# Altium project DCDC.PrjPCB
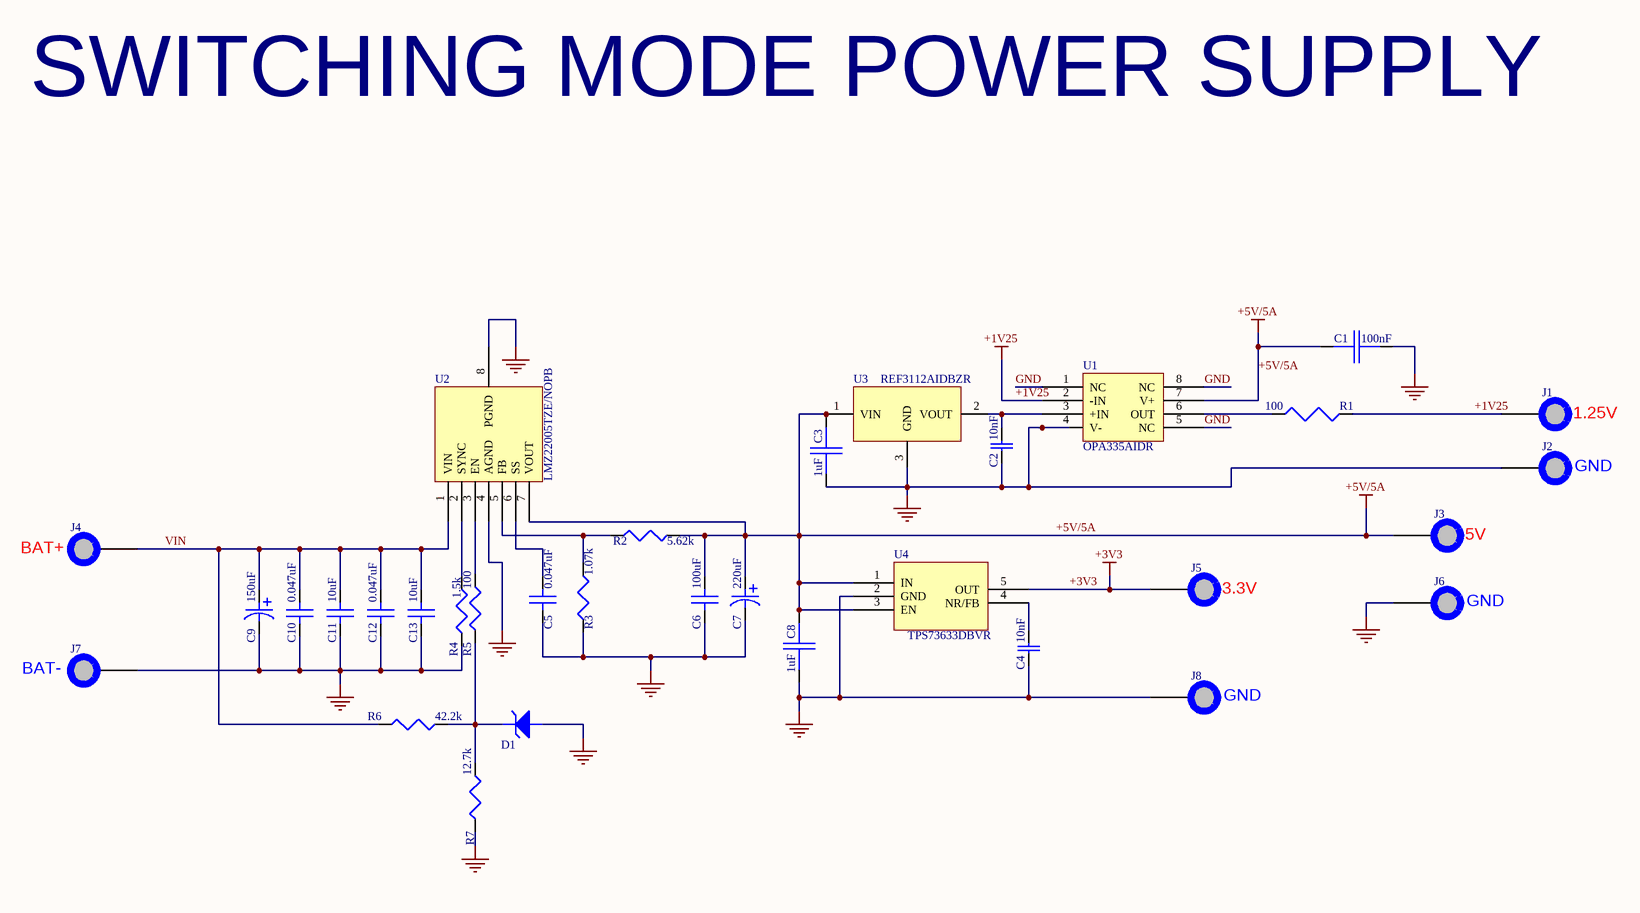
[diagram p0: DCDC.SchDoc]
1 sheet, 33 parts. Net scope: global (net labels, ports and power ports of the same name join across sheets).
Board file: DCDC.PcbDoc

## Sheet DCDC.SchDoc
size A3

### Parts
C1  100nF  [C0603]
C2  10nF  [C0805]
C3  1uF  [C0603]
C4  10nF  [C0805]
C5  0.047uF  [C1206]
C6  100uF  [C1210]
C7  220uF  [EEF-UE]
C8  1uF  [C0603]
C9  150uF  [FK-G]
C10  0.047uF  [C1206]
C11  10uF  [C1206]
C12  0.047uF  [C1206]
C13  10uF  [C1206]
D1  MMSZ5231BS-7-F  [SOD323]  (value not drawn)
J1  PAD_4mmx1.5mm_Hole  [PAD_WITH_HOLE_4x1mm]  (value not drawn)
J2  PAD_4mmx1.5mm_Hole  [PAD_WITH_HOLE_4x1mm]  (value not drawn)
J3  PAD_4mmx1.5mm_Hole  [PAD_WITH_HOLE_4x1mm]  (value not drawn)
J4  PAD_4mmx1.5mm_Hole  [PAD_WITH_HOLE_4x1mm]  (value not drawn)
J5  PAD_4mmx1.5mm_Hole  [PAD_WITH_HOLE_4x1mm]  (value not drawn)
J6  PAD_4mmx1.5mm_Hole  [PAD_WITH_HOLE_4x1mm]  (value not drawn)
J7  PAD_4mmx1.5mm_Hole  [PAD_WITH_HOLE_4x1mm]  (value not drawn)
J8  PAD_4mmx1.5mm_Hole  [PAD_WITH_HOLE_4x1mm]  (value not drawn)
R1  100  [R0603]
R2  5.62k  [R0805]
R3  1.07k  [R0805]
R4  1.5k  [R0805]
R5  100  [R0805]
R6  42.2k  [R0805]
R7  12.7k  [R0805]
U1  OPA335AIDR  [SO-8]
U2  LMZ22005TZE/NOPB  [NDW0007A]
U3  REF3112AIDBZR  [SOT-23]
U4  TPS73633DBVR  [SOT23-5]

### Nets
+1V25: J1.1 R1.1 U1.2(-IN)
+3V3: J5.1 U4.5(OUT)
+5V/5A: C1.2 C3.2 C6.1 C7.1 C8.2 J3.1 R2.2 U1.7(V+) U2.7(VOUT) U3.1(VIN) U4.1(IN) U4.3(EN)
GND: C1.1 C2.1 C3.1 C4.1 C5.2 C6.2 C7.2 C8.1 C9.2 C10.2 C11.1 C12.2 C13.1 D1.1 J2.1 J6.1 J7.1 J8.1 R3.1 R4.1 R7.2 U1.1(NC) U1.4(V-) U1.5(NC) U1.8(NC) U2.4(AGND) U2.8(PGND) U3.3(GND) U4.2(GND)
VIN: C9.1 C10.1 C11.2 C12.1 C13.2 J4.1 R6.1 U2.1(VIN)
NetC2_2: C2.2 U1.3(+IN) U3.2(VOUT)
NetC4_2: C4.2 U4.4(NR/FB)
NetC5_1: C5.1 U2.6(SS)
NetD1_2: D1.2 R5.1 R6.2 R7.1
NetR1_2: R1.2 U1.6(OUT)
NetR2_1: R2.1 R3.2 U2.5(FB)
NetR4_2: R4.2 U2.2(SYNC)
NetR5_2: R5.2 U2.3(EN)

### Notes on the sheet
- SWITCHING MODE POWER SUPPLY
- (near J1) 1.25V
- (near J2) GND
- (near J4) BAT+
- (near J5) 3.3V
- (near J3) 5V
- (near J6) GND
- (near J7) BAT-
- (near J8) GND

### Library data of the parts
C1 = GRM188R71E104KA01D: CAP CER 0.1UF 25V X7R 0603; Manufacturer: Murata Electronics North America; Capacitance: 0.1µF; Tolerance: ±10%; Supplier 1: Digi-Key; Manufacturer Part Number: GRM188R71E104KA01D; RoHS: RoHS Compliant; Category: Capacitors; Stock 1: 5973420; Pricing 1: 1=0.1, 10=0.019, 50=0.0104, 100=0.0088, 250=0.0072, 500=0.00616, 1000=0.0048 (USD); Packaging: Cut Tape (CT); Voltage - Rated: 25V; Temperature Coefficient: X7R; Mounting Type: Surface Mount, MLCC; Operating Temperature: -55°C ~ 125°C; Applications: General Purpose; Ratings: -; Package / Case: 0603 (1608 Metric); Size / Dimension: 0.063" L x 0.031" W (1.60mm x 0.80mm); Height - Seated (Max): -; Thickness (Max): 0.035" (0.90mm); Lead Spacing: -; Features: -; Lead Style: -; ComponentLink1URL: http://www.murata.com/~/media/webrenewal/support/library/catalog/products/capacitor/mlcc/c02e.pdf; ComponentLink1Description: http://www.murata.com/~/media/webrenewal/support/library/catalog/products/capacitor/mlcc/c02e.pdf; Supplier Part Number 1: 490-1524-1-ND
C2 C4 = GRM216R71H103KA01D: CAP CER 10000PF 50V X7R 0805; Manufacturer: Murata Electronics North America; Tolerance: ±10%; Supplier 1: Digi-Key; Manufacturer Part Number: GRM216R71H103KA01D; RoHS: RoHS Compliant; Category: Capacitors; Stock 1: 1473285; Pricing 1: 1=0.1, 10=0.031, 50=0.0168, 100=0.0142, 250=0.01164, 500=0.00998, 1000=0.00777 (USD); Packaging: Cut Tape (CT); Capacitance: 10000pF; Voltage - Rated: 50V; Temperature Coefficient: X7R; Mounting Type: Surface Mount, MLCC; Operating Temperature: -55°C ~ 125°C; Applications: General Purpose; Ratings: -; Package / Case: 0805 (2012 Metric); Size / Dimension: 0.079" L x 0.049" W (2.00mm x 1.25mm); Height - Seated (Max): -; Thickness (Max): 0.028" (0.70mm); Lead Spacing: -; Features: -; Lead Style: -; ComponentLink1URL: http://www.murata.com/~/media/webrenewal/support/library/catalog/products/capacitor/mlcc/c02e.pdf; ComponentLink1Description: http://www.murata.com/~/media/webrenewal/support/library/catalog/products/capacitor/mlcc/c02e.pdf; Supplier Part Number 1: 490-1664-1-ND
C3 C8 = GRM188R61E105KA12D: CAP CER 1UF 25V X5R 0603; Manufacturer: Murata Electronics North America; Capacitance: 1µF; Tolerance: ±10%; Supplier 1: Digi-Key; Manufacturer Part Number: GRM188R61E105KA12D; RoHS: RoHS Compliant; Category: Capacitors; Stock 1: 1934941; Pricing 1: 1=0.1, 10=0.044, 50=0.0238, 100=0.0202, 250=0.01652, 500=0.01412, 1000=0.01101 (USD); Packaging: Cut Tape (CT); Voltage - Rated: 25V; Temperature Coefficient: X5R; Mounting Type: Surface Mount, MLCC; Operating Temperature: -55°C ~ 85°C; Applications: General Purpose; Ratings: -; Package / Case: 0603 (1608 Metric); Size / Dimension: 0.063" L x 0.031" W (1.60mm x 0.80mm); Height - Seated (Max): -; Thickness (Max): 0.035" (0.90mm); Lead Spacing: -; Features: -; Lead Style: -; ComponentLink1URL: http://www.murata.com/~/media/webrenewal/support/library/catalog/products/capacitor/mlcc/c02e.pdf; ComponentLink1Description: http://www.murata.com/~/media/webrenewal/support/library/catalog/products/capacitor/mlcc/c02e.pdf; Supplier Part Number 1: 490-3897-1-ND
C5 C10 C12 = C1206C474K5RACTU: CAP CER 0.47UF 50V X7R 1206; Manufacturer: Kemet; Capacitance: 0.47µF; Tolerance: ±10%; Supplier 1: Digi-Key; Manufacturer Part Number: C1206C474K5RACTU; RoHS: RoHS Compliant; Category: Capacitors; Stock 1: 21625; Pricing 1: 1=0.34, 10=0.295, 50=0.1794, 100=0.1477, 250=0.11816, 500=0.10762, 1000=0.09706 (USD); Packaging: Cut Tape (CT); Voltage - Rated: 50V; Temperature Coefficient: X7R; Mounting Type: Surface Mount, MLCC; Operating Temperature: -55°C ~ 125°C; Applications: General Purpose; Ratings: -; Package / Case: 1206 (3216 Metric); Size / Dimension: 0.126" L x 0.063" W (3.20mm x 1.60mm); Height - Seated (Max): -; Thickness (Max): 0.039" (1.00mm); Lead Spacing: -; Features: -; Lead Style: -; ComponentLink1URL: http://www.kemet.com/docfinder?Partnumber=C1206C474K5RACTU; ComponentLink1Description: http://www.kemet.com/docfinder?Partnumber=C1206C474K5RACTU; Supplier Part Number 1: 399-3498-1-ND
C6 = C3225X5R0J107M250AC: CAP CER 100UF 6.3V X5R 1210; Manufacturer: TDK Corporation; Capacitance: 100µF; Tolerance: ±20%; Supplier 1: Digi-Key; Manufacturer Part Number: C3225X5R0J107M250AC; RoHS: RoHS Compliant; Category: Capacitors; Stock 1: 64128; Pricing 1: 1=1.32, 10=1.103, 100=0.7041, 250=0.58676, 500=0.52808 (USD); Packaging: Cut Tape (CT); Voltage - Rated: 6.3V; Temperature Coefficient: X5R; Mounting Type: Surface Mount, MLCC; Operating Temperature: -55°C ~ 85°C; Applications: General Purpose; Ratings: -; Package / Case: 1210 (3225 Metric); Size / Dimension: 0.126" L x 0.098" W (3.20mm x 2.50mm); Height - Seated (Max): -; Thickness (Max): 0.114" (2.90mm); Lead Spacing: -; Features: -; Lead Style: -; ComponentLink1URL: https://product.tdk.com/info/en/catalog/datasheets/mlcc_commercial_general_en.pdf; ComponentLink1Description: https://product.tdk.com/info/en/catalog/datasheets/mlcc_commercial_general_en.pdf; Supplier Part Number 1: 445-1437-1-ND
C7 = EEF-UE0J221LR: CAP POLYMER 220UF 20% 6.3V SMD; Manufacturer: Panasonic Electronic Components; Capacitance: 220µF; ESR (Equivalent Series Resistance): 7 mOhm; Lifetime @ Temp.: 1000 Hrs @ 105°C; Ripple Current: 3.7A; Surface Mount Land Size: 0.287" L x 0.169" W (7.30mm x 4.30mm); Supplier 1: Digi-Key; Manufacturer Part Number: EEF-UE0J221LR; RoHS: RoHS Compliant; Category: Capacitors; Stock 1: 5849; Pricing 1: 1=3.48, 10=2.885, 25=2.758, 50=2.673, 100=2.5458, 250=2.37608, 500=2.1215, 1000=1.6972 (USD); Packaging: Cut Tape (CT); Tolerance: ±20%; Voltage Rating: 6.3V; Operating Temperature: -40°C ~ 105°C; Type: Polymer; Applications: -; Impedance: -; Lead Spacing: -; Size / Dimension: 0.287" L x 0.169" W (7.30mm x 4.30mm); Height - Seated (Max): 0.165" (4.20mm); Mounting Type: Surface Mount; Package / Case: 2917 (7343 Metric); ComponentLink1URL: http://media.digikey.com/pdf/Data%20Sheets/Panasonic%20Capacitors%20PDFs/FD_CD_UD_UE_Rev_Mar2015.pdf; ComponentLink1Description: http://media.digikey.com/pdf/Data%20Sheets/Panasonic%20Capacitors%20PDFs/FD_CD_UD_UE_Rev_Mar2015.pdf; Supplier Part Number 1: PCE4263CT-ND
C9 = EEE-FK1H151P: CAP ALUM 150UF 20% 50V SMD; Manufacturer: Panasonic Electronic Components; Capacitance: 150µF; Lifetime @ Temp.: 2000 Hrs @ 105°C; Type: Polar; Ripple Current: 502.5mA; Impedance: 180 mOhm; Surface Mount Land Size: 0.406" L x 0.406" W (10.30mm x 10.30mm); Supplier 1: Digi-Key; Manufacturer Part Number: EEE-FK1H151P; RoHS: RoHS Compliant; Category: Capacitors; Stock 1: 50085; Pricing 1: 1=1.09, 50=0.6968, 100=0.6271, 250=0.54004 (USD); Packaging: Cut Tape (CT); Tolerance: ±20%; Voltage Rating: 50V; ESR (Equivalent Series Resistance): -; Operating Temperature: -55°C ~ 105°C; Applications: Automotive; Lead Spacing: -; Size / Dimension: 0.394" Dia (10.00mm); Height - Seated (Max): 0.402" (10.20mm); Mounting Type: Surface Mount; Package / Case: Radial, Can - SMD; ComponentLink1URL: http://industrial.panasonic.com/www-cgi/jvcr13pz.cgi?E+PZ+4+ABA0120+EEEFK1H151P+8+WW; ComponentLink1Description: http://industrial.panasonic.com/www-cgi/jvcr13pz.cgi?E+PZ+4+ABA0120+EEEFK1H151P+8+WW; Supplier Part Number 1: PCE3810CT-ND
C11 C13 = GRM31CR61H106KA12L: CAP CER 10UF 50V X5R 1206; Manufacturer: Murata Electronics North America; Capacitance: 10µF; Tolerance: ±10%; Supplier 1: Digi-Key; Manufacturer Part Number: GRM31CR61H106KA12L; RoHS: RoHS Compliant; Category: Capacitors; Stock 1: 91419; Pricing 1: 1=0.65, 10=0.624, 50=0.3724, 100=0.3026, 250=0.25136, 500=0.2281, 1000=0.20948 (USD); Packaging: Cut Tape (CT); Voltage - Rated: 50V; Temperature Coefficient: X5R; Mounting Type: Surface Mount, MLCC; Operating Temperature: -55°C ~ 85°C; Applications: General Purpose; Ratings: -; Package / Case: 1206 (3216 Metric); Size / Dimension: 0.126" L x 0.063" W (3.20mm x 1.60mm); Height - Seated (Max): -; Thickness (Max): 0.071" (1.80mm); Lead Spacing: -; Features: -; Lead Style: -; ComponentLink1URL: http://www.murata.com/~/media/webrenewal/support/library/catalog/products/capacitor/mlcc/c02e.pdf; ComponentLink1Description: http://www.murata.com/~/media/webrenewal/support/library/catalog/products/capacitor/mlcc/c02e.pdf; Supplier Part Number 1: 490-5961-1-ND
D1 = MMSZ5231BS-7-F: DIODE ZENER 5.1V 200MW SOD323; Manufacturer: Diodes Incorporated; Tolerance: ±5%; Impedance (Max) (Zzt): 17 Ohm; Current - Reverse Leakage @ Vr: 5µA @ 2V; Voltage - Forward (Vf) (Max) @ If: 900mV @ 10mA; Supplier 1: Digi-Key; Manufacturer Part Number: MMSZ5231BS-7-F; RoHS: RoHS Compliant; Category: Discrete Semiconductor Products; Stock 1: 8256; Pricing 1: 1=0.27, 10=0.222, 100=0.1174, 500=0.0772, 1000=0.0526 (USD); Packaging: Cut Tape (CT); Voltage - Zener (Nom) (Vz): 5.1V; Power - Max: 200mW; Operating Temperature: -65°C ~ 150°C; Mounting Type: Surface Mount; Package / Case: SC-76, SOD-323; Supplier Device Package: SOD-323; ComponentLink1URL: http://www.diodes.com/_files/datasheets/ds31038.pdf; ComponentLink1Description: http://www.diodes.com/_files/datasheets/ds31038.pdf; Supplier Part Number 1: MMSZ5231BS-FDICT-ND
J1-J8 = PAD_4mmx1.5mm_Hole: Pad 4mm x 1.5mm with hole
R1 = ERJ-3EKF1000V: RES SMD 100 OHM 1% 1/10W 0603; Manufacturer: Panasonic Electronic Components; Power (Watts): 0.1W, 1/10W; Temperature Coefficient: ±100ppm/°C; Supplier 1: Digi-Key; Manufacturer Part Number: ERJ-3EKF1000V; RoHS: RoHS Compliant; Category: Resistors; Stock 1: 2225240; Pricing 1: 1=0.1, 50=0.0114, 100=0.0084, 250=0.00644, 500=0.00514, 1000=0.00379 (USD); Packaging: Cut Tape (CT); Resistance (Ohms): 100; Tolerance: ±1%; Composition: Thick Film; Features: Automotive AEC-Q200; Operating Temperature: -55°C ~ 155°C; Package / Case: 0603 (1608 Metric); Supplier Device Package: 0603; Size / Dimension: 0.063" L x 0.031" W (1.60mm x 0.80mm); Height: 0.022" (0.55mm); Number of Terminations: 2; ComponentLink1URL: http://industrial.panasonic.com/www-cgi/jvcr13pz.cgi?E+PZ+3+AOA0002+ERJ3EKF1000V+7+WW; ComponentLink1Description: http://industrial.panasonic.com/www-cgi/jvcr13pz.cgi?E+PZ+3+AOA0002+ERJ3EKF1000V+7+WW; Supplier Part Number 1: P100HCT-ND
R2 = CRCW08055K62FKEAHP: RES SMD 5.62K OHM 1% 1/3W 0805; Manufacturer: Vishay Dale; Power (Watts): 0.333W, 1/3W; Temperature Coefficient: ±100ppm/°C; Supplier 1: Digi-Key; Manufacturer Part Number: CRCW08055K62FKEAHP; RoHS: RoHS Compliant; Category: Resistors; Stock 1: 970; Pricing 1: 1=0.25, 10=0.212, 25=0.154, 50=0.1116, 100=0.0828, 250=0.06352, 500=0.05006, 1000=0.03465, 2500=0.03176 (USD); Packaging: Cut Tape (CT); Resistance (Ohms): 5.62k; Tolerance: ±1%; Composition: Thick Film; Features: Automotive AEC-Q200, Pulse Withstanding; Operating Temperature: -55°C ~ 155°C; Package / Case: 0805 (2012 Metric); Supplier Device Package: 0805 (2012 Metric); Size / Dimension: 0.079" L x 0.049" W (2.00mm x 1.25mm); Height: 0.024" (0.60mm); Number of Terminations: 2; ComponentLink1URL: http://www.vishay.com/docs/20043/crcwhpe3.pdf; ComponentLink1Description: http://www.vishay.com/docs/20043/crcwhpe3.pdf; Supplier Part Number 1: 541-5.62KTCT-ND
R3 = ERJ-6ENF1071V: RES SMD 1.07K OHM 1% 1/8W 0805; Manufacturer: Panasonic Electronic Components; Power (Watts): 0.125W, 1/8W; Temperature Coefficient: ±100ppm/°C; Supplier 1: Digi-Key; Manufacturer Part Number: ERJ-6ENF1071V; RoHS: RoHS Compliant; Category: Resistors; Stock 1: 61402; Pricing 1: 1=0.1, 50=0.022, 100=0.0162, 250=0.01236, 500=0.0099, 1000=0.00729 (USD); Packaging: Cut Tape (CT); Resistance (Ohms): 1.07k; Tolerance: ±1%; Composition: Thick Film; Features: Automotive AEC-Q200; Operating Temperature: -55°C ~ 155°C; Package / Case: 0805 (2012 Metric); Supplier Device Package: 0805; Size / Dimension: 0.079" L x 0.049" W (2.00mm x 1.25mm); Height: 0.028" (0.70mm); Number of Terminations: 2; ComponentLink1URL: http://industrial.panasonic.com/www-cgi/jvcr13pz.cgi?E+PZ+3+AOA0002+ERJ6ENF1071V+7+WW; ComponentLink1Description: http://industrial.panasonic.com/www-cgi/jvcr13pz.cgi?E+PZ+3+AOA0002+ERJ6ENF1071V+7+WW; Supplier Part Number 1: P1.07KCCT-ND
R4 = ERJ-6ENF1501V: RES SMD 1.5K OHM 1% 1/8W 0805; Manufacturer: Panasonic Electronic Components; Power (Watts): 0.125W, 1/8W; Temperature Coefficient: ±100ppm/°C; Supplier 1: Digi-Key; Manufacturer Part Number: ERJ-6ENF1501V; RoHS: RoHS Compliant; Category: Resistors; Stock 1: 278373; Pricing 1: 1=0.1, 50=0.022, 100=0.0162, 250=0.01236, 500=0.0099, 1000=0.00729 (USD); Packaging: Cut Tape (CT); Resistance (Ohms): 1.5k; Tolerance: ±1%; Composition: Thick Film; Features: Automotive AEC-Q200; Operating Temperature: -55°C ~ 155°C; Package / Case: 0805 (2012 Metric); Supplier Device Package: 0805; Size / Dimension: 0.079" L x 0.049" W (2.00mm x 1.25mm); Height: 0.028" (0.70mm); Number of Terminations: 2; ComponentLink1URL: http://industrial.panasonic.com/www-cgi/jvcr13pz.cgi?E+PZ+3+AOA0002+ERJ6ENF1501V+7+WW; ComponentLink1Description: http://industrial.panasonic.com/www-cgi/jvcr13pz.cgi?E+PZ+3+AOA0002+ERJ6ENF1501V+7+WW; Supplier Part Number 1: P1.50KCCT-ND
R5 = RCA0805100RFKEA: RES SMD 100 OHM 1% 1/8W 0805; Manufacturer: Vishay Dale; Power (Watts): 0.125W, 1/8W; Temperature Coefficient: ±100ppm/°C; Supplier 1: Digi-Key; Manufacturer Part Number: RCA0805100RFKEA; RoHS: RoHS Compliant; Category: Resistors; Stock 1: 9515; Pricing 1: 1=0.4, 10=0.285, 25=0.2104, 50=0.1552, 100=0.1139, 250=0.09404, 500=0.07756, 1000=0.0561, 2500=0.05198 (USD); Packaging: Cut Tape (CT); Resistance (Ohms): 100; Tolerance: ±1%; Composition: Thick Film; Features: Anti-Sulfur, Automotive AEC-Q200; Operating Temperature: -55°C ~ 155°C; Package / Case: 0805 (2012 Metric); Supplier Device Package: 0805 (2012 Metric); Size / Dimension: 0.079" L x 0.049" W (2.01mm x 1.25mm); Height: 0.020" (0.50mm); Number of Terminations: 2; ComponentLink1URL: http://www.vishay.com/docs/20037/rcae3.pdf; ComponentLink1Description: http://www.vishay.com/docs/20037/rcae3.pdf; Supplier Part Number 1: 541-2221-1-ND
R6 = ERJ-6ENF4222V: RES SMD 42.2K OHM 1% 1/8W 0805; Manufacturer: Panasonic Electronic Components; Power (Watts): 0.125W, 1/8W; Temperature Coefficient: ±100ppm/°C; Supplier 1: Digi-Key; Manufacturer Part Number: ERJ-6ENF4222V; RoHS: RoHS Compliant; Category: Resistors; Stock 1: 28681; Pricing 1: 1=0.1, 50=0.022, 100=0.0162, 250=0.01236, 500=0.0099, 1000=0.00729 (USD); Packaging: Cut Tape (CT); Resistance (Ohms): 42.2k; Tolerance: ±1%; Composition: Thick Film; Features: Automotive AEC-Q200; Operating Temperature: -55°C ~ 155°C; Package / Case: 0805 (2012 Metric); Supplier Device Package: 0805; Size / Dimension: 0.079" L x 0.049" W (2.00mm x 1.25mm); Height: 0.028" (0.70mm); Number of Terminations: 2; ComponentLink1URL: http://industrial.panasonic.com/www-cgi/jvcr13pz.cgi?E+PZ+3+AOA0002+ERJ6ENF4222V+7+WW; ComponentLink1Description: http://industrial.panasonic.com/www-cgi/jvcr13pz.cgi?E+PZ+3+AOA0002+ERJ6ENF4222V+7+WW; Supplier Part Number 1: P42.2KCCT-ND
R7 = ERJ-6ENF1272V: RES SMD 12.7K OHM 1% 1/8W 0805; Manufacturer: Panasonic Electronic Components; Power (Watts): 0.125W, 1/8W; Temperature Coefficient: ±100ppm/°C; Supplier 1: Digi-Key; Manufacturer Part Number: ERJ-6ENF1272V; RoHS: RoHS Compliant; Category: Resistors; Stock 1: 59301; Pricing 1: 1=0.1, 50=0.022, 100=0.0162, 250=0.01236, 500=0.0099, 1000=0.00729 (USD); Packaging: Cut Tape (CT); Resistance (Ohms): 12.7k; Tolerance: ±1%; Composition: Thick Film; Features: Automotive AEC-Q200; Operating Temperature: -55°C ~ 155°C; Package / Case: 0805 (2012 Metric); Supplier Device Package: 0805; Size / Dimension: 0.079" L x 0.049" W (2.00mm x 1.25mm); Height: 0.028" (0.70mm); Number of Terminations: 2; ComponentLink1URL: http://industrial.panasonic.com/www-cgi/jvcr13pz.cgi?E+PZ+3+AOA0002+ERJ6ENF1272V+7+WW; ComponentLink1Description: http://industrial.panasonic.com/www-cgi/jvcr13pz.cgi?E+PZ+3+AOA0002+ERJ6ENF1272V+7+WW; Supplier Part Number 1: P12.7KCCT-ND
U1 = OPA335AIDR: IC OPAMP CHOPPER 2MHZ RRO 8SOIC; Manufacturer: Texas Instruments; Amplifier Type: Zero-Drift; Number of Circuits: 1; Output Type: Rail-to-Rail; Slew Rate: 1.6 V/µs; Current - Input Bias: 70pA; Voltage - Input Offset: 1µV; Current - Supply: 285µA; Current - Output / Channel: 50mA; Voltage - Supply, Single/Dual (±): 2.7 V ~ 5.5 V, ±1.35 V ~ 2.75 V; Supplier 1: Digi-Key; Manufacturer Part Number: OPA335AIDR; RoHS: RoHS Compliant; Category: Integrated Circuits (ICs); Stock 1: 1160; Pricing 1: 1=2.89, 10=2.594, 100=2.0805, 500=1.71, 1000=1.4155 (USD); Packaging: Cut Tape (CT); Gain Bandwidth Product: 2MHz; -3db Bandwidth: -; Operating Temperature: -40°C ~ 125°C; Mounting Type: Surface Mount; Package / Case: 8-SOIC (0.154", 3.90mm Width); Supplier Device Package: 8-SOIC; ComponentLink1URL: http://www.ti.com/lit/ds/symlink/opa334.pdf; ComponentLink1Description: http://www.ti.com/lit/ds/symlink/opa334.pdf; Supplier Part Number 1: 296-39124-1-ND
U2 = LMZ22005TZE/NOPB: IC BUCK SYNC 20V 5A TO-PMOD-7; Manufacturer: Texas Instruments; Number of Outputs: 1; Voltage - Input (Min): 6V; Voltage - Output 1: 0.8 ~ 6 V; Efficiency: 92%; Supplier 1: Digi-Key; Manufacturer Part Number: LMZ22005TZE/NOPB; RoHS: RoHS Compliant; Category: Power Supplies - Board Mount; Stock 1: 2634; Pricing 1: 1=10.45, 5=10.374, 10=10.296, 25=10.1424, 50=9.8352, 100=8.9132 (USD); Packaging: Cut Tape (CT); Type: Non-Isolated PoL Module; Voltage - Input (Max): 20V; Voltage - Output 2: -; Voltage - Output 3: -; Current - Output (Max): 5A; Power (Watts) - Manufacture Series: -; Voltage - Isolation: -; Applications: ITE (Commercial); Features: UVLO; Mounting Type: Surface Mount; Package / Case: TO-PMOD-7, Power Module; Size / Dimension: 0.40" L x 0.54" W x 0.18" H (10.2mm x 13.8mm x 4.6mm); Operating Temperature: -40°C ~ 125°C; Power (Watts) - Max: -; ComponentLink1URL: http://www.ti.com/lit/ds/symlink/lmz22005.pdf; ComponentLink1Description: http://www.ti.com/lit/ds/symlink/lmz22005.pdf; Supplier Part Number 1: 296-40330-1-ND
U3 = REF3112AIDBZR: IC VREF SERIES 1.25V SOT23-3; Manufacturer: Texas Instruments; Output Type: Fixed; Current - Output: 10mA; Tolerance: ±0.2%; Temperature Coefficient: 20ppm/°C; Noise - 0.1Hz to 10Hz: 17µVp-p; Noise - 10Hz to 10kHz: 24µVrms; Voltage - Input: 1.8 V ~ 5.5 V; Current - Supply: 135µA; Supplier 1: Digi-Key; Manufacturer Part Number: REF3112AIDBZR; RoHS: RoHS Compliant; Category: Integrated Circuits (ICs); Stock 1: 1754; Pricing 1: 1=2.71, 10=2.432, 100=1.9513, 500=1.6038, 1000=1.11375 (USD); Packaging: Cut Tape (CT); Reference Type: Series; Voltage - Output (Min/Fixed): 1.25V; Voltage - Output (Max): -; Current - Cathode: -; Operating Temperature: -40°C ~ 125°C (TA); Mounting Type: Surface Mount; Package / Case: TO-236-3, SC-59, SOT-23-3; Supplier Device Package: SOT-23-3; ComponentLink1URL: http://www.ti.com/lit/ds/symlink/ref3112.pdf; ComponentLink1Description: http://www.ti.com/lit/ds/symlink/ref3112.pdf; Supplier Part Number 1: 296-39158-1-ND
U4 = TPS73633DBVR: IC REG LDO 3.3V 0.4A SOT23-5; Manufacturer: Texas Instruments; Regulator Topology: Positive Fixed; Current - Output: 400mA; Voltage - Dropout (Typical): 0.075V @ 400mA; Number of Regulators: 1; Voltage - Input: Up to 5.5V; Supplier 1: Digi-Key; Manufacturer Part Number: TPS73633DBVR; RoHS: RoHS Compliant; Category: Integrated Circuits (ICs); Stock 1: 11852; Pricing 1: 1=2.05, 10=1.843, 100=1.4783, 500=1.215, 1000=0.84375 (USD); Packaging: Cut Tape (CT); Voltage - Output: 3.3V; Current - Limit (Min): 400mA; Operating Temperature: -40°C ~ 125°C; Mounting Type: Surface Mount; Package / Case: SC-74A, SOT-753; Supplier Device Package: SOT-23-5; ComponentLink1URL: http://www.ti.com/lit/ds/symlink/tps736.pdf; ComponentLink1Description: http://www.ti.com/lit/ds/symlink/tps736.pdf; Supplier Part Number 1: 296-27064-1-ND